# EAGLE design PCR-Badge-2015 (EAGLE 7.7.0)
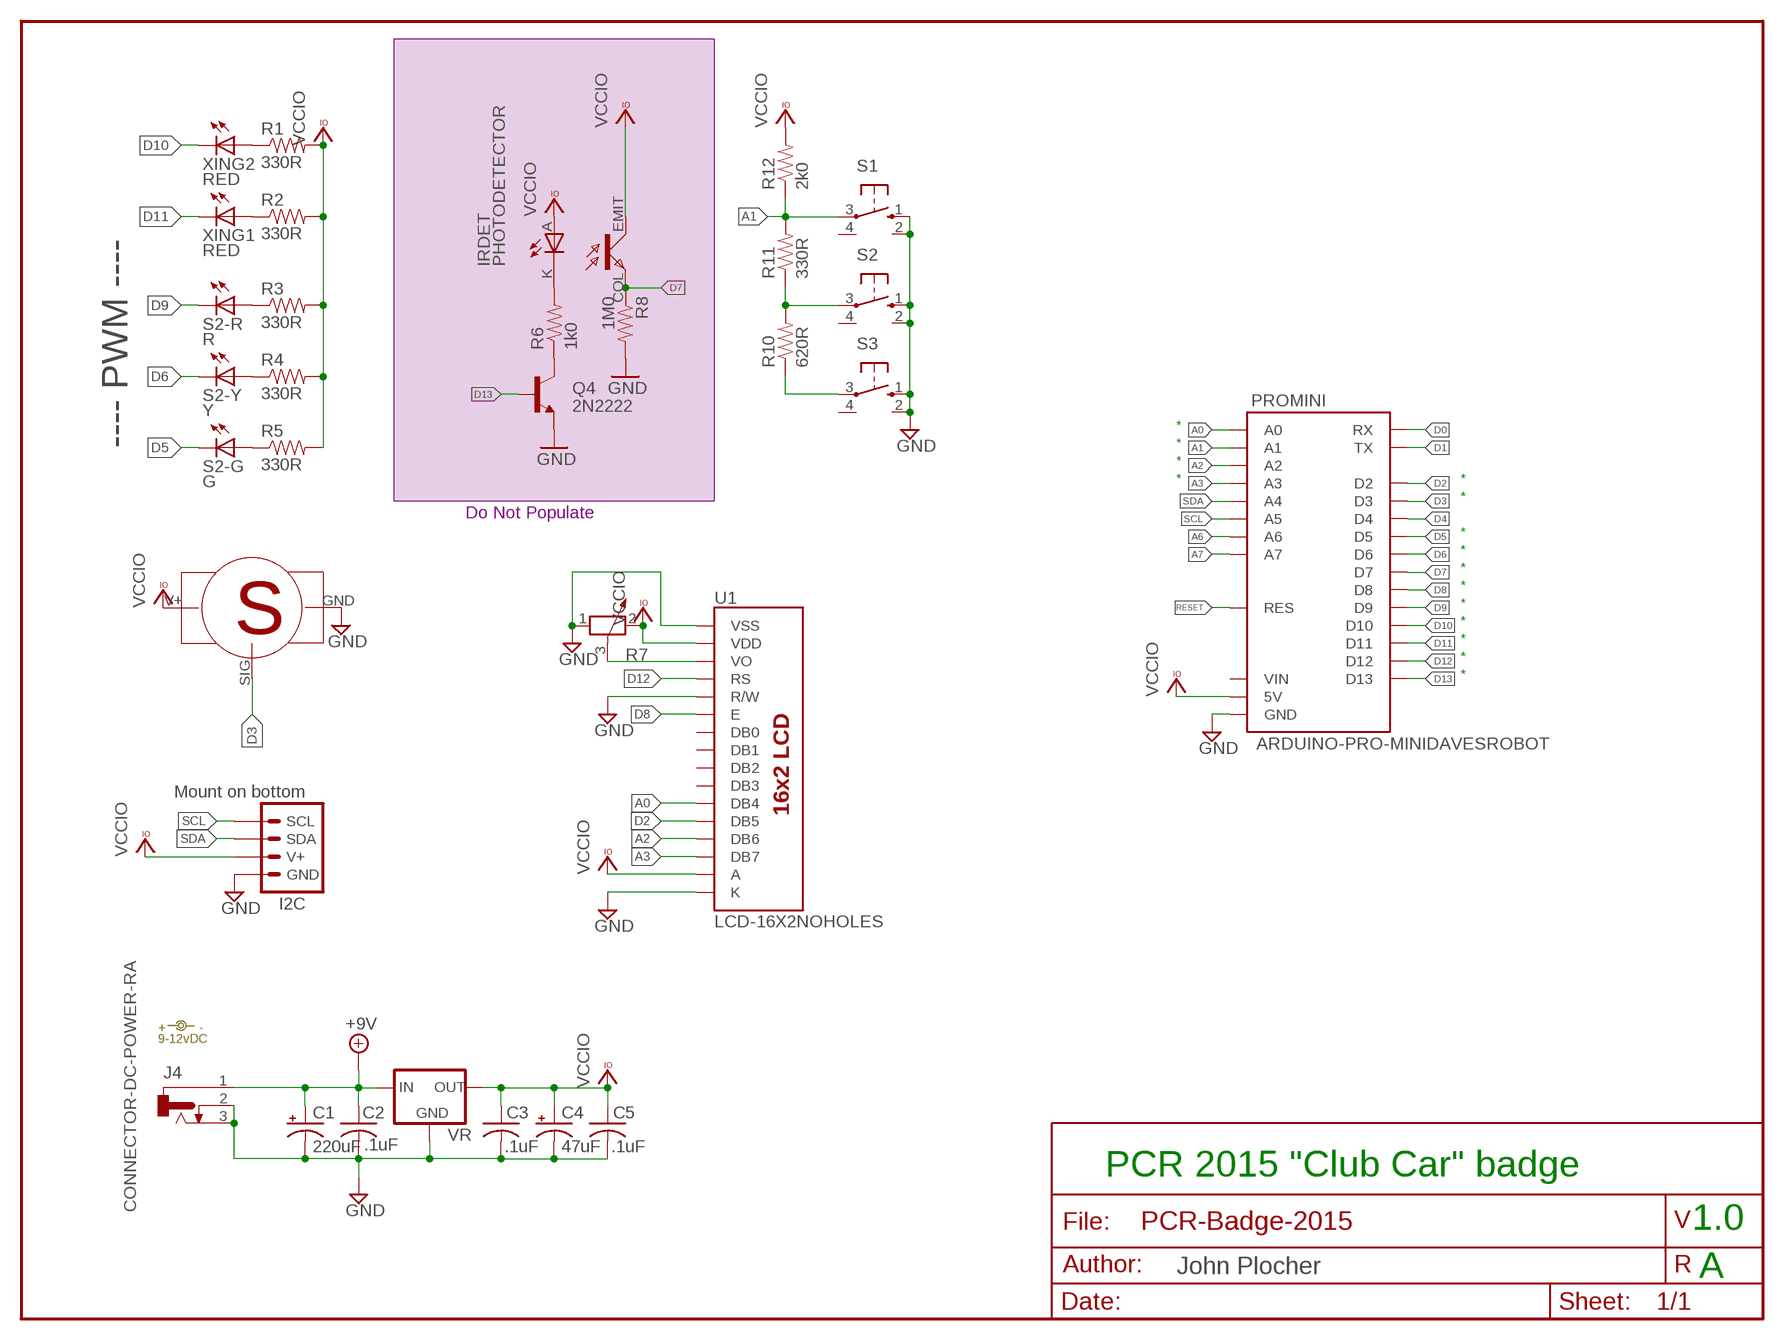
[diagram p0: schematic, sheet 1]

## Parts
C1  220uF  CAP-POLPTH-5MM  [E5-10.5]
C2  .1uF  CAP  [C050-024X044]
C3  .1uF  CAP  [C050-024X044]
C4  47uF  CAP-POLPTH-5MM  [E5-10.5]
C5  .1uF  CAP  [C050-024X044]
I2C  Mount on bottom  CONNECTOR-I2C  [I2C]
IRDET  PHOTODETECTOR  [RPR220]
J4  CONNECTOR-DC-POWER-RA  [DCJ0202]
POWER  9-12vDC  DOC-POWER_LABEL  [POWER_USAGE]
PROMINI  ARDUINO-PRO-MINIDAVESROBOT  [ARDUINO_PRO_MINI_DAVEK]
Q4  2N2222  NPN-TO92  [TO-92]
R1  330R  RPTH-1/6W  [1/6W-RES]
R2  330R  RPTH-1/6W  [1/6W-RES]
R3  330R  RPTH-1/6W  [1/6W-RES]
R4  330R  RPTH-1/6W  [1/6W-RES]
R5  330R  RPTH-1/6W  [1/6W-RES]
R6  1k0  RPTH-1/6W  [1/6W-RES]
R7  R-POTENTIOMETERB25U  [B25U]
R8  1M0  RPTH-1/6W  [1/6W-RES]
R10  620R  RPTH-1/6W  [1/6W-RES]
R11  330R  RPTH-1/6W  [1/6W-RES]
R12  2k0  RPTH-1/6W  [1/6W-RES]
S1  SWITCH-(ON)SMALLPADS  [4P-PTH-6.0X6.0X5.0H]
S2  SWITCH-(ON)SMALLPADS  [4P-PTH-6.0X6.0X5.0H]
S2-G  G  LEDLED5MM  [LED5MM]
S2-R  R  LEDLED5MM  [LED5MM]
S2-Y  Y  LEDLED5MM  [LED5MM]
S3  SWITCH-(ON)SMALLPADS  [4P-PTH-6.0X6.0X5.0H]
SERVO  SERVO  [SERVO]
SERVO1  SERVO  SERVO-CUTOUT  [SERVO-9G]
U1  LCD-16X2NOHOLES  [LCD-16X2_NOHOLES]
VR  VREG_78XX-TO-220  [TO-220-ALT]
XING1  RED  LEDLED5MM  [LED5MM]
XING2  RED  LEDLED5MM  [LED5MM]

## Nets
+9V [Power]: C1.+ C2.1 J4.1 VR.IN
A0 [signals]: PROMINI.AD0(A0) U1.11(DB4)
A1 [signals]: PROMINI.AD1(A1) R11.2 R12.1 S1.3(P)
A2 [signals]: PROMINI.AD2(A2) U1.13(DB6)
A3 [signals]: PROMINI.AD3(A3) U1.14(DB7)
A6 [signals]: PROMINI.AD6(A6)
A7 [signals]: PROMINI.AD7(A7)
D0 [signals]: PROMINI.RX
D1 [signals]: PROMINI.TX@1(TX)
D2 [signals]: PROMINI.D2 U1.12(DB5)
D3 [signals]: PROMINI.D3 SERVO.SIG(PWM)
D4 [signals]: PROMINI.D4
D5 [signals]: PROMINI.D5 S2-G.K(C)
D6 [signals]: PROMINI.D6 S2-Y.K(C)
D7 [signals]: IRDET.COL PROMINI.D7 R8.1
D8 [signals]: PROMINI.D8 U1.6(E)
D9 [signals]: PROMINI.D9 S2-R.K(C)
D10 [signals]: PROMINI.D10 XING2.K(C)
D11 [signals]: PROMINI.D11 XING1.K(C)
D12 [signals]: PROMINI.D12 U1.4(RS)
D13 [signals]: PROMINI.D13 Q4.2(B)
GND [Power]: C1.- C2.2 C3.2 C4.- C5.2 I2C.GND J4.2 J4.3 PROMINI.GND@1(GND) PROMINI.GND@2(GND) PROMINI.GND@4(GND) Q4.1(E) R7.1 R8.2 S1.1(S) S1.2(S1) S2.1(S) S2.2(S1) S3.1(S) S3.2(S1) SERVO.GND U1.1(VSS) U1.5(R/W) U1.16(K) VR.GND
IRDRIVE4 [Power]: Q4.3(C) R6.1
N$1: R1.1 XING2.A
N$2: R2.1 XING1.A
N$3: R3.1 S2-R.A
N$4: R4.1 S2-Y.A
N$5: R5.1 S2-G.A
N$6: IRDET.K R6.2
N$8 [Power]: R10.2 R11.1 S2.3(P)
N$9 [Power]: R10.1 S3.3(P)
RESET [signals]: PROMINI.RES PROMINI.RES@1(RES)
SCL [signals]: I2C.SCL PROMINI.AD5(A5)
SDA [signals]: I2C.SDA PROMINI.AD4(A4)
VCCIO [Power]: C3.1 C4.+ C5.1 I2C.V+ IRDET.A IRDET.EMIT PROMINI.5V R1.2 R2.2 R3.2 R4.2 R5.2 R7.2 R12.2 SERVO.V+ U1.2(VDD) U1.15(A) VR.OUT
VO [Power]: R7.3 U1.3(VO)
Unconnected: PROMINI.VIN S1.4(P1) S2.4(P1) S3.4(P1) U1.7(DB0) U1.8(DB1) U1.9(DB2) U1.10(DB3)

## Notes on the sheet
- *
- ---- PWM ---- | *
- *
- * | *
- *
- Do Not Populate
- *
- *
- *
- *
- *
- *
- *
- *
- *
- PCR 2015 "Club Car" badge
- 1.0
- A

## Library data of the parts
C1 C4 = SPCoast:CAP-POL*
C2 C3 C5 = SPCoast:CAP*
I2C = SPCoast:CONNECTOR-I2C
IRDET = SPCoast:PHOTODETECTOR
J4 = SPCoast:CONNECTOR-DC-POWER: DC POWER JACK Source: DCJ0202.pdf
POWER = SPCoast:DOC-POWER_LABEL
PROMINI = SPCoast:ARDUINO-PRO-MINI
Q4 = SPCoast:NPN: Transistor NPN BJT configuration in SOT23 package. MMBT2222 is the common NPN we use. Double check BCE configuration again layout.
R1-R6 R8 R10-R12 = SPCoast:R*: Resistor Basic schematic elements and footprints for 0603, 1206, and PTH 1/10th watt (small) resistors.
R7 = SPCoast:R-POTENTIOMETER: Potentiometer
S1-S3 = SPCoast:SWITCH-(ON): OMRON SWITCH; BEST: TS-1109; OMRON: B3F-10XX; OPL: 3110040P1
S2-G S2-R S2-Y XING1 XING2 = SPCoast:LED*
SERVO = SPCoast:SERVO
SERVO1 = SPCoast:SERVO-CUTOUT
U1 = SparkFun-Displays:LCD-16X2: Standard text-only 16x2 parallel input LCD
VR = SPCoast:VREG_78XX: Voltage Regulator Standard 7805 5V regulator. IGO (Input Ground Output). Spark Fun Electronics SKU : COM-00107

## Net classes
0 default: width 0.305 mm
1 Power: width 0.305 mm, clearance 0.254 mm
2 signals: width 0.305 mm, drill 0.5 mm

## Board
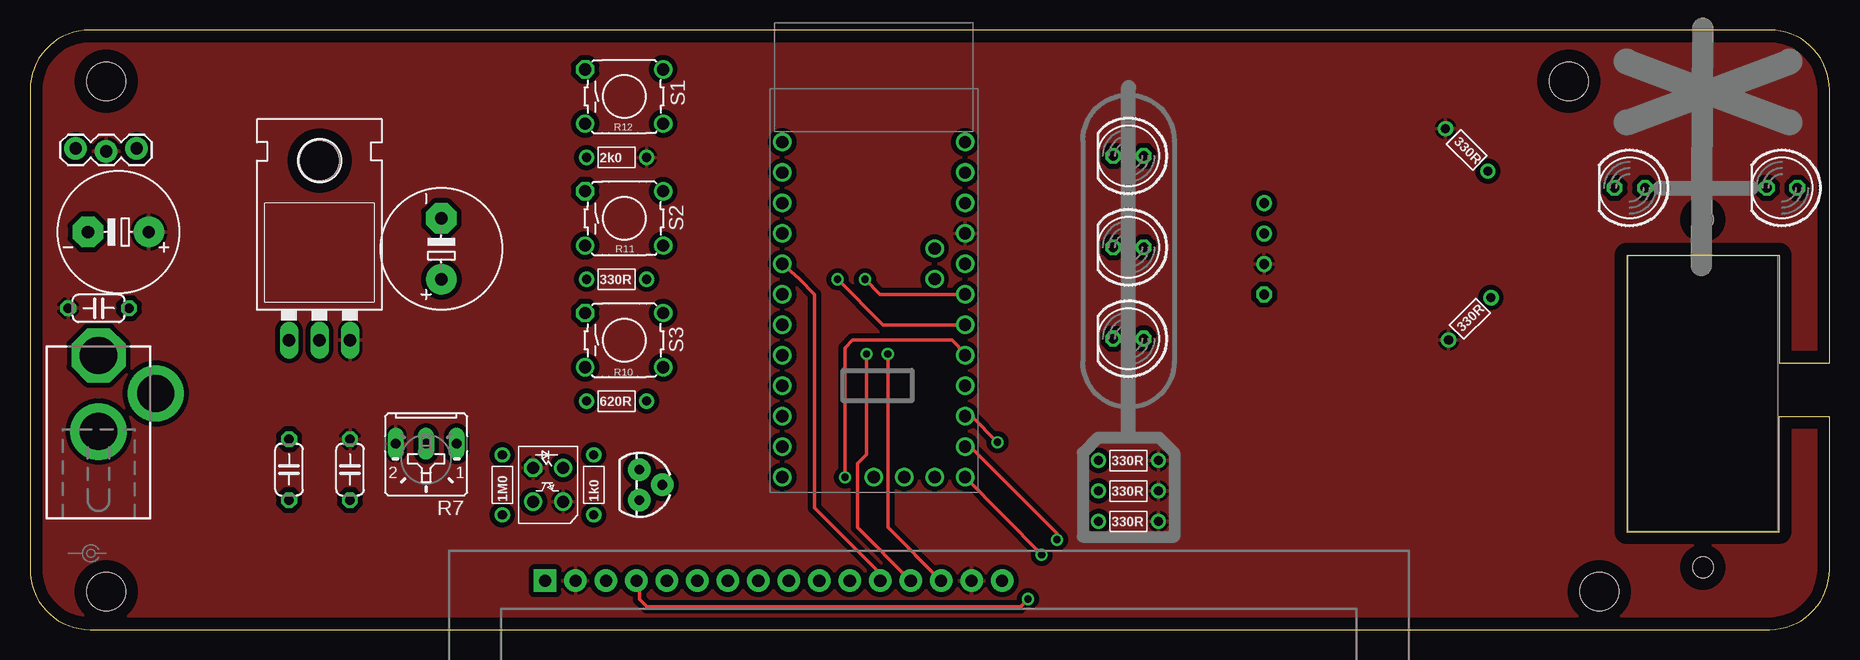
[diagram p1: board, top side]
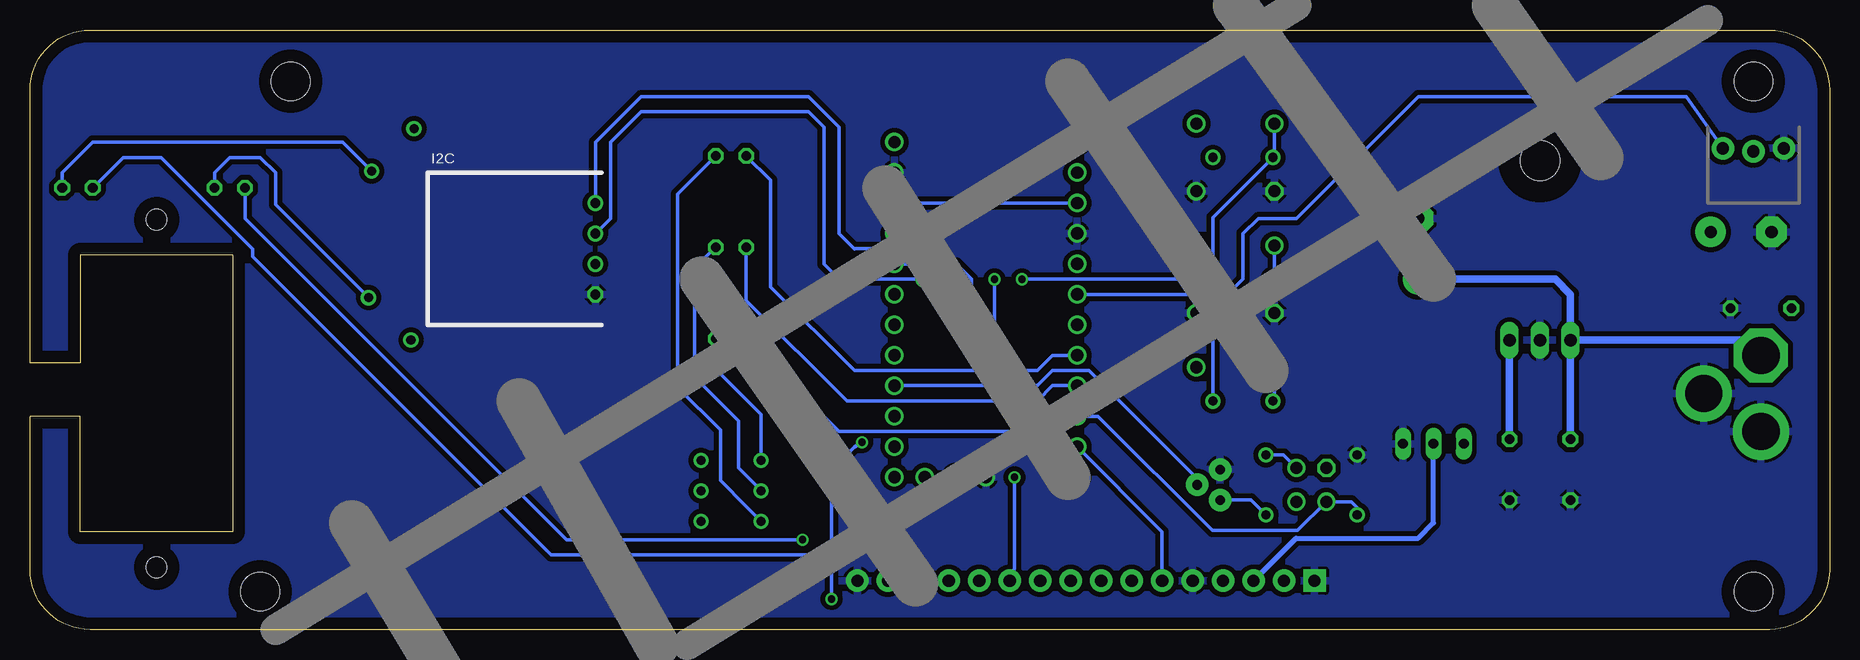
[diagram p2: board, bottom side, seen from below]

Size 150 x 50 mm. Coordinates in mm from the lower left corner, seen from the top.
Outline: 0,5 arc90 5,0 145,0 arc90 150,5 150,17.78 145.8,17.78 145.8,8.13 133.1,8.13 133.1,31.24 145.8,31.24 145.8,22.23 150,22.23 150,45 arc90 145,50 5,50 arc90 0,45 0,5
Copper layers (1*16): Top 0.035mm / dielectric 1.5mm / Bottom 0.035mm
Design rules "default": minimum track width 10mil, minimum drill 0.6mm, track to track 8mil, track to pad 8mil, pad to pad 8mil, via to via 8mil, smd to smd 8mil, copper to edge 40mil, drill to drill 8mil, minimum pad ring 10mil, minimum via ring 8mil, stop-mask expansion 4mil, vias tented up to drill 0mil, thermal gap 10mil
Holes 3.2 mm at 6.35,45.72 128.27,45.72 6.35,3.17 130.81,3.17

### Footprints (pad centres in the part's own frame; a part is rotated, then mirrored left to right if it is on the bottom)
E5-10.5 = drill 1.016 pad 2.54: + -2.54,0 | drill 1.016 pad 2.54 octagon: - 2.54,0
C050-024X044 = drill 0.813 octagon: 1 -2.54,0; 2 2.54,0
I2C = drill 0.8 octagon: GND 3.81,0 | drill 0.8: SCL -3.81,0; SDA -1.27,0; V+ 1.27,0
RPR220 = drill 1 octagon: A -1.4,-1.25 | drill 1: COL 1.4,-1.25; EMIT 1.4,1.25; K -1.4,1.25
DCJ0202 = drill 3.1 pad 4.5 octagon: 1 0,3.175 | drill 3.1 pad 4.7: 2 4.763,0; 3 0,-3.175
ARDUINO_PRO_MINI_DAVEK = drill 1.016: 5V 16.51,21.59; AD0 16.51,11.43; AD1 16.51,13.97; AD2 16.51,16.51; AD3 16.51,19.05; AD4 13.97,17.78; AD5 13.97,20.32; AD6 11.43,1.27; AD7 13.97,1.27; D2 1.27,19.05; D3 1.27,16.51; D4 1.27,13.97; D5 1.27,11.43; D6 1.27,8.89; D7 1.27,6.35; D8 1.27,3.81; D9 1.27,1.27; D10 16.51,1.27; D11 16.51,3.81; D12 16.51,6.35; D13 16.51,8.89; GND@1 16.51,26.67; GND@2 8.89,1.27; GND@4 1.27,21.59; RES 16.51,24.13; RES@1 1.27,24.13; RX 1.27,26.67; TX@1 1.27,29.21; VIN 16.51,29.21
TO-92 = drill 0.813 pad 1.88: 1 -1.27,0; 2 0,1.905; 3 1.27,0
1/6W-RES = drill 0.762: 1 -2.5,0; 2 2.5,0
B25U = drill 0.813 long: 1 -2.54,-0.889; 2 2.54,-0.889; 3 0,-0.889
4P-PTH-6.0X6.0X5.0H = drill 1.016 octagon: 1 -3.251,2.261 | drill 1.016: 2 3.251,2.261; 3 -3.251,-2.261; 4 3.251,-2.261
LED5MM = drill 0.813 octagon: A -1.27,0; K 1.27,0
SERVO = drill 1.016 pad 1.88: GND 2.54,-0.127; SIG -2.54,-0.127; V+ 0,0.127
SERVO-9G = hole 1.7: -14.5,0; 14.5,0
LCD-16X2_NOHOLES = drill 1.016 pad 1.88 square: 1 -32,15.5 | drill 1.016 pad 1.88: 2 -29.46,15.5; 3 -26.92,15.5; 4 -24.38,15.5; 5 -21.84,15.5; 6 -19.3,15.5; 7 -16.76,15.5; 8 -14.22,15.5; 9 -11.68,15.5; 10 -9.14,15.5; 11 -6.6,15.5; 12 -4.06,15.5; 13 -1.52,15.5; 14 1.02,15.5; 15 3.56,15.5; 16 6.1,15.5
TO-220-ALT = drill 1.016 long: GND 0,-3.81; IN -2.54,-3.81; OUT 2.54,-3.81 | hole 3.302: 0,11.176

### Placement (x,y rotation side)
C1  34.29,31.75 90 top
C2  21.59,13.34 270 top
C3  26.67,13.34 270 top
C4  7.37,33.15 180 top
C5  5.71,26.8 0 top
I2C  102.87,31.75 270 bottom
IRDET  43.18,12.06 270 top
J4  5.71,19.68 0 top
POWER  5.08,6.35 270 top
PROMINI  61.44,11.45 0 top
Q4  50.8,12.06 270 top
R1  119.76,40.01 135 top
R2  120.02,25.91 225 top
R3  91.57,14.1 0 top
R4  91.57,11.56 0 top
R5  91.57,9.02 0 top
R6  46.99,12.06 90 top
R7  33.02,14.61 180 top
R8  39.37,12.06 90 top
R10  48.9,19.05 0 top
R11  48.9,29.21 0 top
R12  48.9,39.37 0 top
S1  49.53,44.45 0 top
S2  49.53,34.29 0 top
S2-G  91.57,39.5 180 top
S2-R  91.57,24.26 180 top
S2-Y  91.57,31.88 180 top
S3  49.53,24.13 0 top
SERVO  6.35,40.01 180 top
SERVO1  139.45,19.68 90 top
U1  74.93,-11.43 0 top
VR  24.13,27.94 0 top
XING1  133.35,36.83 180 top
XING2  146.05,36.83 180 top

### Tracks (layer width: path | path; a pad name or v marks a point on that pad's centre or on a via)
+9V
  Bottom 0.61: VR.IN C2.1 | J4.1 6.99,24.13 VR.IN | VR.IN 21.59,27.94 22.86,29.21 C1.+
A0  (via drill 0.6)
  Top 0.305: v67.94,12.7 67.94,23.5 68.58,24.13 76.83,24.13 77.95,23.02 PROMINI.AD0
  Bottom 0.305: U1.11 67.94,5.09 v67.94,12.7
A1  (via drill 0.6)
  Top 0.305: v67.31,29.21 71.11,25.41 PROMINI.AD1
  Bottom 0.305: S1.3 46.28,39.49 R12.1 51.4,34.37 R11.2 v67.31,29.21
A2  (via drill 0.6)
  Top 0.305: U1.13 68.96,8.52 68.96,13.84 69.72,14.61 v69.72,22.99 | v69.6,29.21 70.85,27.95 PROMINI.AD2
  Bottom 0.305: v69.6,29.21 69.6,23.11 v69.72,22.99
A3  (via drill 0.6)
  Top 0.305: v71.5,22.99 71.5,8.52 U1.14
  Bottom 0.305: PROMINI.AD3 72.86,30.48 72.77,30.48 71.5,29.21 v71.5,22.99
D2
  Top 0.305: PROMINI.D2 64.14,29.23 65.41,27.95 65.41,10.16 70.87,4.7 U1.12
D3
  Bottom 0.305: PROMINI.D3 62.7,27.94 50.16,27.94 48.9,29.21 48.9,33.02 47.62,34.29 44.45,34.29 34.29,44.45 11.94,44.45 SERVO.SIG
D5
  Bottom 0.305: PROMINI.D5 64.75,22.88 66.04,21.59 81.28,21.59 88.27,28.57 88.27,37.47 S2-G.K
D6
  Bottom 0.305: PROMINI.D6 64.75,20.34 66.04,19.05 81.92,19.05 90.3,27.43 S2-Y.K
D7
  Bottom 0.305: PROMINI.D7 62.7,17.78 60.96,17.78 51.44,8.26 44.34,8.26 IRDET.COL 41.91,10.64 39.85,10.64 39.37,10.16 R8.1
D8
  Bottom 0.305: U1.6 55.64,8.14 PROMINI.D8
D9
  Bottom 0.305: PROMINI.D9 67.33,16.52 69.85,16.51 81.28,16.51 82.55,16.51 S2-R.K
D10  (via drill 0.6)
  Top 0.305: PROMINI.D10 84.3,6.25 v84.33,6.22
  Bottom 0.305: v84.33,6.22 106.55,6.22 131.44,31.11 131.44,31.75 139.06,39.37 142.24,39.37 XING2.K
D11  (via drill 0.6)
  Top 0.305: PROMINI.D11 78.34,15.26 85.6,8 v85.6,7.49
  Bottom 0.305: v85.6,7.49 105.28,7.49 132.08,34.29 XING1.K
D12  (via drill 0.6)
  Top 0.305: U1.4 50.8,3.82 50.8,2.54 51.44,1.91 82.55,1.91 v83.19,2.54 | v80.64,15.62 78.47,17.8 PROMINI.D12
  Bottom 0.305: v83.19,2.54 83.19,13.34 81.28,15.24 v80.64,15.62
D13
  Bottom 0.305: PROMINI.D13 66.03,20.34 64.77,21.59 61.72,21.59 52.7,12.57 Q4.2
GND
  pour Bottom (isolate 0.406): -1.27,50.8 151.13,50.8 151.13,-1.27 -1.27,-1.27
IRDRIVE4
  Bottom 0.305: R6.1 48.22,10.79 Q4.3
N$1
  Bottom 0.305: R1.1 123.93,40.64 144.78,40.64 147.32,38.1 XING2.A
N$2
  Bottom 0.305: R2.1 129.54,35.43 129.54,38.1 130.81,39.37 133.35,39.37 134.62,38.1 XING1.A
N$3
  Bottom 0.305: S2-R.A 92.84,21.72 89.07,17.95 R3.1
N$4
  Bottom 0.305: R4.1 89.07,11.6 90.93,13.46 90.93,17.4 94.61,21.08 94.61,30.1 S2-Y.A
N$5
  Bottom 0.305: R5.1 90.3,10.29 92.46,12.45 92.46,16.64 96.01,20.19 96.01,36.32 S2-G.A
N$6
  Bottom 0.305: IRDET.K 45.53,14.56 R6.2
N$8
  Bottom 0.305: S2.3 46.28,29.33 R11.1 51.4,24.21 R10.2
N$9
  Bottom 0.305: R10.1 46.28,19.17 S3.3
RESET
  Bottom 0.305: PROMINI.RES PROMINI.RES@1
SCL
  Bottom 0.305: PROMINI.AD5 81.27,31.77 81.28,31.75 82.55,33.02 82.55,41.91 85.09,44.45 99.06,44.45 102.87,40.64 I2C.SCL
SDA
  Bottom 0.305: PROMINI.AD4 82.53,29.23 82.55,29.21 83.82,30.48 83.82,41.91 85.09,43.18 99.06,43.18 101.6,40.64 101.6,34.29 I2C.SDA
VCCIO
  Bottom 0.61: VR.OUT C3.1
  pour Top (isolate 0.406): 0,50.8 151.13,50.8 151.13,-1.27 -1.27,-1.27 -1.27,50.8
VO
  Bottom 0.406: U1.3 44.46,7.62 34.29,7.62 33.02,8.89 R7.3

### Text on the board
tDocu: A1 | SERVO | D5 | D3 | D11 | D10 | Club | D6 | 2015 | Car | D9 | SERVO | D13 | 'duino / Railroad / Demo Board | D7 | PCR | LCD | RS D12 / E D8 / DB4 A0 / DB5 D2 / DB6 A2 / DB7 A3 | HELLO My Name Is / John Plocher
bDocu: 2015.04 / / Designed by / John Plocher & / Dave Falkenburg | Made in the PCR, Coast Division, NMRA | orange | red | SERVO | brown (gnd) | Made by | Go Bears! | www.SPCoast.com | Model / Railroading / is Fun!